# Altium project ElregSender_2022.PrjPcb (part 2 of 2)

## Sheet Sender_CH1.SchDoc
size A4
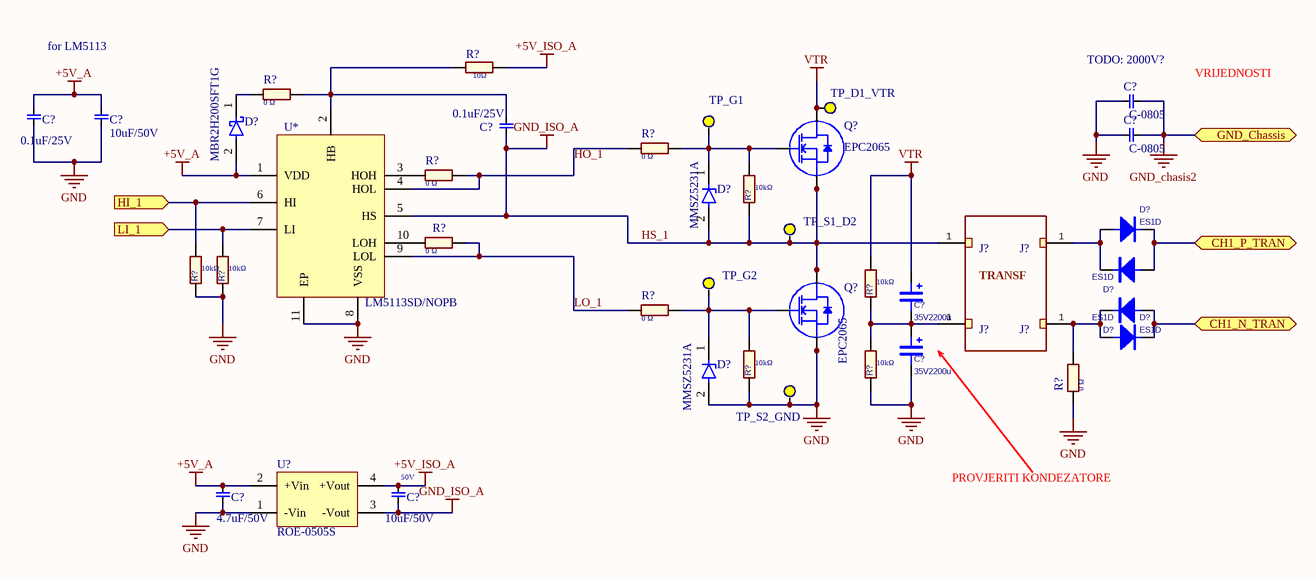
[diagram p3: Sender_CH1.SchDoc]

### Parts
(Parts that share a designator on the sheet are numbered #1, #2 ... from top to bottom, then left to right.)
C?#21  C-0805  [C-0805]
C?#22  0.1uF/25V  [C-0603]
C?#23  10uF/50V  [CAP-1210]
C?#24  0.1uF/25V  [C-0603]
C?#25  C-0805  [C-0805]
C?#26  35V2200u  [CAP_16X25]
C?#27  35V2200u  [CAP_16X25]
C?#28  4.7uF/50V  [FP-C2012X7R1H475K125AC-IPC_B]
C?#29  10uF/50V  Voltage: 50V  [CAP-1210]
D?#3  MBR2H200SFT1G  [FP-498-MFG]
D?#4  MMSZ5231A  [SOD-123]
D?#5  ES1D  [SMA]
D?#6  ES1D  [SMA]
D?#7  ES1D  [SMA]
D?#8  ES1D  [SMA]
D?#9  MMSZ5231A  [SOD-123]
J?#5  CON1_b  [CONN1 _b]  (value not drawn)
J?#6  CON1_b  [CONN1 _b]  (value not drawn)
J?#7  CON1_b  [CONN1 _b]  (value not drawn)
J?#8  CON1_b  [CONN1 _b]  (value not drawn)
Q?#1  EPC2065  [D0320T34M]
Q?#2  EPC2065  [D0320T34M]
R?#9  Resistance: 10Ω  [RES 0603_1608]  (hidden comment: RC0603FR-0710RL)
R?#10  Resistance: 0 Ω  [RES 0603_1608]  (hidden comment: RC0603JR-070RL)
R?#11  Resistance: 0 Ω  [RES 0603_1608]  (hidden comment: RC0603JR-070RL)
R?#12  Resistance: 0 Ω  [RES 0603_1608]  (hidden comment: RC0603JR-070RL)
R?#13  Resistance: 10kΩ  [RES 0603_1608]  (hidden comment: RC0603FR-0710KL)
R?#14  Resistance: 0 Ω  [RES 0603_1608]  (hidden comment: RC0603JR-070RL)
R?#15  Resistance: 10kΩ  [RES 0603_1608]  (hidden comment: RC0603FR-0710KL)
R?#16  Resistance: 10kΩ  [RES 0603_1608]  (hidden comment: RC0603FR-0710KL)
R?#17  Resistance: 0 Ω  [RES 0603_1608]  (hidden comment: RC0603JR-070RL)
R?#18  Resistance: 10kΩ  [RES 0603_1608]  (hidden comment: RC0603FR-0710KL)
R?#19  Resistance: 0 Ω  [RES 0603_1608]  (hidden comment: RC0603JR-070RL)
R?#20  Resistance: 10kΩ  [RES 0603_1608]  (hidden comment: RC0603FR-0710KL)
R?#21  Resistance: 10kΩ  [RES 0603_1608]  (hidden comment: RC0603FR-0710KL)
TP_D1_VTR  Test_Point  [Test_Point]  (value not drawn)
TP_G1  Test_Point  [Test_Point]  (value not drawn)
TP_G2  Test_Point  [Test_Point]  (value not drawn)
TP_S1_D2  Test_Point  [Test_Point]  (value not drawn)
TP_S2_GND  Test_Point  [Test_Point]  (value not drawn)
U*  LM5113SD/NOPB  [WSON-10]
U?#4  ROE-0505S  [ROE-0505S-MFG]

### Blocks framed on the sheet
TRANSF: J?#5 J?#7

### Ports
CH1_N_TRAN (bidir), CH1_P_TRAN (bidir), GND_Chassis (bidir), HI_1 (in), LI_1 (in)

### Nets
+5V_A: C?#22.1(G) C?#23.2(G) C?#28.2(G) D?#3.2(A) U*.1(VDD) U?#4.2(+Vin)
+5V_ISO_A: C?#29.2(G) R?#9.2 U?#4.4(+Vout)
GND: C?#21.1(G) C?#22.2(G) C?#23.1(G) C?#25.1(G) C?#27.2 C?#28.1(G) D?#9.2(A) Q?#2.2(S) Q?#2.4(S) Q?#2.6(S) Q?#2.8(S) R?#15.1 R?#16.1 R?#19.1 R?#20.1 R?#21.1 TP_S2_GND.1 U*.8(VSS) U*.11(EP) U?#4.1(-Vin)
GND_chasis2: C?#21.2(G) C?#25.2(G) ; port GND_Chassis
HS_1: C?#24.1(G) C?#29.1(G) D?#4.2(A) J?#5.1 Q?#1.2(S) Q?#1.4(S) Q?#1.6(S) Q?#1.8(S) Q?#2.3(D) Q?#2.5(D) Q?#2.7(D) R?#13.1 TP_S1_D2.1 U*.5(HS) U?#4.3(-Vout)  [also labelled GND_ISO_A]
VTR: C?#26.1 Q?#1.3(D) Q?#1.5(D) Q?#1.7(D) R?#18.2 TP_D1_VTR.1
HO_1: R?#11.1 R?#12.2 U*.4(HOL)
LO_1: R?#14.2 R?#17.1 U*.9(LOL)
NetC?#24_2: C?#24.2(G) R?#9.1 R?#10.2 U*.2(HB)
NetC?#26_2: C?#26.2 C?#27.1 J?#7.1 R?#18.1 R?#21.2
NetD?#3_1: D?#3.1(C) R?#10.1
NetD?#4_1: D?#4.1(C) Q?#1.1(G) R?#11.2 R?#13.2 TP_G1.1
NetD?#5_1: D?#5.1(A) D?#6.2(C) J?#6.1
NetD?#5_2: D?#5.2(C) D?#6.1(A) ; port CH1_P_TRAN
NetD?#7_1: D?#7.1(A) D?#8.2(C) J?#8.1 R?#19.2
NetD?#7_2: D?#7.2(C) D?#8.1(A) ; port CH1_N_TRAN
NetD?#9_1: D?#9.1(C) Q?#2.1(G) R?#17.2 R?#20.2 TP_G2.1
NetR?#12_1: R?#12.1 U*.3(HOH)
NetR?#14_1: R?#14.1 U*.10(LOH)
NetR?#15_2: R?#15.2 U*.6(HI) ; port HI_1
NetR?#16_2: R?#16.2 U*.7(LI) ; port LI_1

### Notes on the sheet
- for LM5113
- (near C?#21) TODO: 2000V?
- VRIJEDNOSTI
- PROVJERITI KONDEZATORE

### Library data of the parts
C?#21 C?#25 = C-0805: Manufacturer 1: Yageo; Manufacturer Part Number 1: CC1206KKX7RBBB332; Tolerance: ±10%; Voltage - Rated: 500V; Temperature Coefficient: X7R; Notification: Current market demand for these product types have resulted in fluctuating and extending lead times. Lead times may differ.; Description 1: CAP CER 3300PF 500V X7R 1206; Category 1: Capacitors; Packaging: Cut Tape (CT); Part Status: Active; Operating Temperature: -55°C ~ 125°C; Features: -; Ratings: -; Applications: General Purpose; Failure Rate: -; Mounting Type: Surface Mount, MLCC; Package / Case: 1206 (3216 Metric); Size / Dimension: 0.126" L x 0.063" W (3.20mm x 1.60mm); Height - Seated (Max): -; Thickness (Max): 0.057" (1.45mm); Lead Spacing: -; Lead Style: -; ComponentLink1URL: http://www.yageo.com/documents/recent/UPY-NP0X7R_MV_100-to-630V_21.pdf; ComponentLink1Description: http://www.yageo.com/documents/recent/UPY-NP0X7R_MV_100-to-630V_21.pdf; Supplier 1: Digi-Key; Supplier Part Number 1: 311-1506-1-ND; RoHS 1: RoHS Compliant; Stock 1: 4928; Pricing 1: 1=0.31, 10=0.214, 100=0.1085, 500=0.07424, 1000=0.06568 (USD)
C?#22 C?#24 = 06033C104JAZ2A: 0.1µF ±5% 25V Ceramic Capacitor X7R 0603 (1608 Metric); Manufacturer: Kyocera AVX; Capacitance: 100nF; ComponentLink1URL: http://catalogs.avx.com/SurfaceMount.pdf?src-supplier=Digi-Key; ComponentLink1Description: http://catalogs.avx.com/SurfaceMount.pdf?src-supplier=Digi-Key; Case/Package: 0603; Category: Ceramic Capacitors; Dielectric: X7R; Features: Soft Termination; Length: 0.063inch; Manufacturer Part Number: 06033C104JAZ2A; Max Operating Temperature: 125°C; Min Operating Temperature: -55°C; Mount: Surface Mount; Package Quantity: 4000; Packaging: Tape and Reel; RoHS Compliant: Yes; Thickness: 0.035inch; Tolerance: 5%; Voltage Rating: 25V; Voltage Rating (DC): 25V; Width: 0.031inch
C?#23 C?#29 = CL32B106KBJNNNE: 10 µF 50V ±10%  Ceramic Capacitor X7R 1210 (3225 Metric); Manufacturer: Samsung; Capacitance: 10uF; ComponentLink1URL: https://datasheet.ciiva.com/25766/cl32b106kbjnnne-25766545.pdf?src-supplier=Digi-Key; ComponentLink1Description: https://datasheet.ciiva.com/25766/cl32b106kbjnnne-25766545.pdf?src-supplier=Digi-Key; Case/Package: 1210; Category: Ceramic Capacitors; Dielectric: X7R; Length: 3.2mm; Manufacturer Part Number: CL32B106KBJNNNE; Max Operating Temperature: 125°C; Min Operating Temperature: -55°C; Mount: Surface Mount; Package Quantity: 1; Packaging: Tape and Reel; RoHS Compliant: Yes; Thickness: 0.106inch; Tolerance: 10%; Voltage Rating: 50V; Voltage Rating (DC): 50V; Width: 0.098inch; Supplier 1: Mouser; Supplier 2: Mouser; Case Code (Imperial): 1210; Case Code (Metric): 3225; Construction: Flat; Depth: 2.5mm; Height: 2.5mm; Lead Free: Lead Free; Material: Ceramic; Radiation Hardening: No; Series: CL; Supplier Packaging 1: Tape & Reel; Supplier Unit Price 1: $0.59; Supplier Location 1: US; Supplier Part Number 1: 187-CL32B106KBJNNNE; Supplier Part Number 2: 187-CL32B106KBJNNNE
  C?#23: Voltage: 50V
C?#26 C?#27 = CAP_2200uF_35V: Capacitor; Manufacturer: Kemet; Manufacturer Part Number: ESH228M035AM7AA; Capacitance: 2200µF; Tolerance: ±20%; Voltage Rating: 35V; Lifetime @ Temp.: 2000 Hrs @ 105°C; Supplier 1: Digi-Key; Supplier Part Number 1: 399-6572-ND; RoHS: RoHS Compliant; Category: Capacitors; Stock 1: 1972; Pricing 1: 1=0.98, 10=0.77, 50=0.6676, 100=0.5778, 250=0.5136, 500=0.43656, 1000=0.3852, 2500=0.35952, 5000=0.34668 (USD); Packaging: Bulk; ESR (Equivalent Series Resistance): -; Operating Temperature: -40°C ~ 105°C; Type: -; Applications: General Purpose; Ripple Current: -; Impedance: -; Lead Spacing: 0.295" (7.50mm); Size / Dimension: 0.630" Dia (16.00mm); Height - Seated (Max): 1.063" (27.00mm); Surface Mount Land Size: -; Mounting Type: Through Hole; Package / Case: Radial, Can; ComponentLink1URL: http://www.kemet.com/docfinder?Partnumber=ESH228M035AM7AA; ComponentLink1Description: http://www.kemet.com/docfinder?Partnumber=ESH228M035AM7AA
C?#28 = C2012X7R1H475K125AC: 4.7uF 50V 10% 0805 T/R Multilayer Ceramic Capacitor; Manufacturer: TDK; Capacitance: 4.7uF; Category: Ceramic Capacitors; Manufacturer Part Number: C2012X7R1H475K125AC; RoHS Compliant: No; Supplier 1: Digi-Key; RoHS: Yes; Stock 1: 123424; Pricing 1: 1=0.57000, 10=0.40600, 50=0.30680, 100=0.26730, 500=0.19800, 1000=0.16830 (USD); Supplier 2: Mouser; Supplier Part Number 2: 810-C2012X7R475K125C; Supplier Part Number 1: 445-C2012X7R1H475K125ACCT-ND; Voltage: 50V
D?#3 = MBR2H200SFT1G: DIODE SCHOTTKY 200V 2A SOD123FL; Manufacturer: ON Semiconductor; Peak Reverse Current: 200uA; Max Surge Forward Current: 30A; Max Junction Temp: +150°C; Standoff Height: 0mm; Device Class L1: Discrete Semiconductors; Package: 498; Temperature Range High: +150°C; Height: 0.98mm; Temperature: -55°C to +150°C; Forward Current: 2A; Octopart: https://octopart.com/mbr2h200sft1g-on+semiconductor-51167333; Reverse Voltage: 200V; Max Repetitive Reverse Voltage: 200V; RoHS: TRUE; Lead Free: Yes; Footprint Url: https://www.onsemi.com/pub/Collateral/498-01.PDF; ComponentLink2Description: Datasheet; Category: Diode; Manufacturer Part Number: MBR2H200SFT1G; Digikey Description: DIODE SCHOTTKY 200V 2A SOD123FL; Device Class L3: Schottky Diodes; Temperature Range Low: -55°C; ComponentLink2URL: https://www.onsemi.com/pub/Collateral/MBR2H200SF-D.PDF; Automotive: No; Device Class L2: Diodes
D?#4 D?#9 = MMSZ5231A_R1_00001: Zener Diode 5.1 V 500 mW ±1.96% Surface Mount SOD-123; Manufacturer: Pan Jit; Element Configuration: Single; Max Power Dissipation: 500mW; Max Reverse Leakage Current: 5uA; Zener Voltage: 5.1V; Radiation Hardening: No; Category: Zener Diodes; Max Operating Temperature: 150°C; Min Operating Temperature: -50°C; Mount: Surface Mount; Number of Pins: 2; RoHS Compliant: Yes; Supplier 1: Digi-Key; Supplier Part Number 1: 3757-MMSZ5231A_R1_00001CT-ND; Supplier Unit Price 1: $0.20; Supplier Location 1: US; Supplier 2: Mouser; Supplier Part Number 2: 241-MMSZ5231AR100001; Supplier Unit Price 2: $0.20; Supplier Location 2: US; Manufacturer Part Number: MMSZ5231A_R1_00001
D?#5-D?#8 = ES1x: Diode; Manufacturer: Fairchild/ON Semiconductor; Diode Type: Standard; Voltage - DC Reverse (Vr) (Max): 200V; Current - Average Rectified (Io): 1A; Voltage - Forward (Vf) (Max) @ If: 920mV @ 1A; Speed: Fast Recovery =< 500ns, > 200mA (Io); Reverse Recovery Time (trr): 15ns; Current - Reverse Leakage @ Vr: 5μA @ 200V; Capacitance @ Vr, F: 7pF @ 4V, 1MHz; Supplier 1: Digi-Key; Supplier Part Number 1: ES1DFSTR-ND; Manufacturer Part Number: ES1D; RoHS: RoHS Compliant; Category: Discrete Semiconductor Products; Stock 1: 135000; Pricing 1: 7500=0.0567, 15000=0.0504, 37500=0.04725, 52500=0.0419, 187500=0.04032 (USD); Packaging: Tape & Reel (TR); Part Status: Active; Mounting Type: Surface Mount; Package / Case: DO-214AC, SMA; Supplier Device Package: SMA (DO-214AC); Operating Temperature - Junction: -55°C ~ 150°C; ComponentLink1URL: https://www.fairchildsemi.com/datasheets/ES/ES1A.pdf; ComponentLink1Description: https://www.fairchildsemi.com/datasheets/ES/ES1A.pdf
Q?#1 Q?#2 = EPC2065: N-Channel 80 V 60A (Ta) Surface Mount Die; QSGdescript: 80 V 60A 3.6mE; MFG: EPC; Part Number: EPC2065; EPC Part Number: EPC2065; Status: Released; Supplier 1: Digi-Key; Supplier Part Number 1: 917-EPC2065TR-ND; Supplier 2: Digi-Key; Supplier 3: Digi-Key; SchDescript: 80 V 60A 3.6mE; MFGPN: EPC2065
R?#9 = RC0603FR-0710RL: 10 Ohms ±1% 0.1W, 1/10W Chip Resistor 0603 (1608 Metric) Moisture Resistant Thick Film; Manufacturer: Yageo; Max Power Dissipation: 100mW; Temperature Coefficient: 200ppm/°C; Voltage Rating: 50V; Case Code (Imperial): 0603; Case Code (Metric): 1608; Case/Package: 0603; Category: Chip SMD Resistors; Construction: Rectangular; Contact Plating: Tin,Matte; Depth: 0.8mm; Features: Moisture Resistant; Height: 0.45mm; Lead Free: Lead Free; Length: 1.6mm; Max Operating Temperature: 155°C; Military Standard: Not; Min Operating Temperature: -55°C; Number of Terminations: 2; Packaging: Tape and Reel; Power Rating: 100mW; Radiation Hardening: No; REACH SVHC: No SVHC; Resistance Tolerance: 1%; Resistor Type: Thick Film; RoHS Compliant: Yes; Series: RC; Size Code: 0603; Technology: THICK FILM; Termination: SMD/SMT; Tolerance: 1%; Supplier 1: Mouser; Supplier Part Number 1: 603-RC0603FR-0710RL; Supplier Packaging 1: Tape & Reel; Supplier Unit Price 1: $0.10; Supplier Location 1: US; Supplier 2: Farnell; Supplier Part Number 2: 9238247; Supplier Packaging 2: Cut Tape; Supplier Unit Price 2: £0.032; Supplier Location 2: GB; Manufacturer Part Number: RC0603FR-0710RL; Number of Pins: 2; Voltage Rating (DC): 50V; Width: 0.8mm
R?#10-R?#12 R?#14 R?#17 = RC0603JR-070RL: 0 Ohms Jumper 0.1W, 1/10W Chip Resistor 0603 (1608 Metric) Moisture Resistant Thick Film; Manufacturer: Yageo; Max Power Dissipation: 100mW; Resistance Tolerance: 5%; Temperature Coefficient: 200ppm/°C; Tolerance: 1%; Voltage Rating: 50V; Case Code (Imperial): 0603; Case Code (Metric): 1608; Case/Package: 0603; Category: Chip SMD Resistors; Construction: Rectangular; Contact Plating: Tin,Matte; Depth: 0.8mm; Features: Moisture Resistant; Height: 0.45mm; Lead Free: Lead Free; Length: 1.6mm; Manufacturer Part Number: RC0603JR-070RL; Max Operating Temperature: 155°C; Military Standard: Not; Min Operating Temperature: -55°C; Number of Pins: 2; Number of Terminations: 2; Package Quantity: 5000; Packaging: Tape and Reel; Power Rating: 100mW; Radiation Hardening: No; REACH SVHC: No SVHC; Resistor Type: Thick Film; RoHS Compliant: Yes; Series: RC; Size Code: 0603; Voltage Rating (DC): 50V; Width: 0.8mm; Technology: THICK FILM; Termination: SMD/SMT; Supplier 1: Digi-Key; Supplier Part Number 1: 311-0.0GRCT-ND; Supplier 2: Mouser; Supplier Part Number 2: 603-RC0603JR-070RL; Supplier 3: Farnell; Supplier Part Number 3: 2421846
R?#13 R?#15 R?#16 R?#18 R?#20 R?#21 = RC0603FR-0710KL: 10 kOhms ±1% 0.1W, 1/10W Chip Resistor 0603 (1608 Metric) Moisture Resistant Thick Film; Manufacturer: Yageo; Max Power Dissipation: 100mW; Temperature Coefficient: 100ppm/°C; Voltage Rating: 75V; Voltage Rating (DC): 50V; Width: 0.8mm; Case Code (Imperial): 0603; Case Code (Metric): 1608; Case/Package: 0603; Category: Chip SMD Resistors; Depth: 0.8mm; Height: 0.45mm; Lead Free: Lead Free; Length: 1.6mm; Manufacturer Part Number: RC0603FR-0710KL; Max Operating Temperature: 155°C; Min Operating Temperature: -55°C; Number of Pins: 2; Number of Terminations: 2; Packaging: Tape and Reel; Power Rating: 100mW; REACH SVHC: Unknown; Resistance Tolerance: 1%; Resistor Type: Thick Film; RoHS Compliant: Yes; Series: RC; Size Code: 0603; Termination: SMD/SMT; Tolerance: 1%; Weight: 7.1E-05oz; Construction: Rectangular; Features: Moisture Resistant; Lead Pitch: 0.3mm; Military Standard: Not; Supplier 1: Digi-Key; Supplier Part Number 1: 311-10.0KHRCT-ND; Supplier Packaging 1: Cut Tape; Supplier Unit Price 1: $0.10; Supplier Location 1: US; Supplier 2: Mouser; Supplier Part Number 2: 603-RC0603FR-0710KL; Supplier Packaging 2: Tape & Reel; Supplier Unit Price 2: $0.10; Supplier Location 2: US
R?#19 = RC0603JR-070RL: 0 Ohms Jumper 0.1W, 1/10W Chip Resistor 0603 (1608 Metric) Moisture Resistant Thick Film; Manufacturer: Yageo; Category 1: Resistors; Max Power Dissipation: 100mW; Resistance Tolerance: 5%; Temperature Coefficient: 200ppm/°C; Tolerance: 1%; Voltage Rating: 50V; Features: Moisture Resistant; Case Code (Imperial): 0603; Case Code (Metric): 1608; Case/Package: 0603; Category: Chip SMD Resistors; Construction: Rectangular; Contact Plating: Tin,Matte; Depth: 0.8mm; Height: 0.45mm; Lead Free: Lead Free; Length: 1.6mm; Max Operating Temperature: 155°C; Military Standard: Not; Min Operating Temperature: -55°C; Number of Pins: 2; Number of Terminations: 2; Package Quantity: 5000; Packaging: Tape and Reel; Power Rating: 100mW; Radiation Hardening: No; REACH SVHC: No SVHC; Resistor Type: Thick Film; RoHS Compliant: Yes; Series: RC; Size Code: 0603; Technology: THICK FILM; Termination: SMD/SMT; Voltage Rating (DC): 50V; Width: 0.8mm; Manufacturer Part Number: RC0603JR-070RL; Supplier 1: Digi-Key; Supplier Part Number 1: 311-0.0GRCT-ND; Supplier 2: Mouser; Supplier Part Number 2: 603-RC0603JR-070RL; Supplier 3: Farnell; Supplier Part Number 3: 2421846
U* = LM5113SD/NOPB: Half-Bridge Gate Driver IC Non-Inverting 10-WSON (4x4); Manufacturer: TI National Semiconductor; Max Output Current: 5A; Fall Time: 4ns; Max Supply Voltage: 5.5V; Min Supply Voltage: 4.5V; Number of Channels: 2; Operating Supply Current: 100uA; Operating Supply Voltage: 5V; Propagation Delay: 30ns; Turn-Off Delay Time: 2ns; Category: Gate Drivers; Lead Free: Lead Free; Max Operating Temperature: 125°C; Min Operating Temperature: -40°C; Mount: Surface Mount; Number of Drivers: 2; Number of Outputs: 2; Number of Pins: 10; Output Current: 5A; Packaging: Tape and Reel; Radiation Hardening: No; REACH SVHC: No SVHC; Rise Time: 4ns; RoHS Compliant: Yes; Series: LM5113; Turn-On Delay Time: 2ns; Supplier 1: Digi-Key; Supplier Part Number 1: LM5113SD/NOPBCT-ND; Supplier Packaging 1: Cut Tape; Supplier Unit Price 1: $6.36; Supplier Location 1: US; Supplier 2: Mouser; Supplier Part Number 2: 926-LM5113SD/NOPB; Supplier Packaging 2: Tape & Reel; Supplier Unit Price 2: $6.36; Supplier Location 2: US; Supplier 3: Farnell; Supplier Part Number 3: 2781701; Supplier Unit Price 3: £5.09; Supplier Location 3: GB; Manufacturer Part Number: LM5113SD/NOPB
U?#4 = ROE-0505S: Isolated Module DC DC Converter 1 Output 5V 200mA 4.5V - 5.5V Input; Manufacturer: Recom; Isolation Voltage: 1kV; Efficiency: 75%; Max Output Power: 1W; Number of Outputs: 1; Case/Package: SIP; Category: Voltage Regulators - Switching; Current - Output 1: 200mA; Depth: 6mm; Height: 10mm; Isolation: Isolated; Lead Free: Lead Free; Length: 11.5mm; Max Input Voltage: 5.5V; Max Input Voltage (DC): 5.5V; Max Operating Temperature: 85°C; Max Output Current: 200mA; Max Output Voltage: 5V; Max Power Dissipation: 1W; Min Input Voltage: 4.5V; Min Input Voltage (DC): 4.5V; Min Operating Temperature: -40°C; Mount: Through Hole; Nominal Input Voltage: 5V; Nominal Output Voltage: 5V; Number of Pins: 4; Output Current: 200mA; Output Power: 1W; Output Voltage: 5V; Package Quantity: 42; Packaging: Rail/Tube; Power Rating: 1W; REACH SVHC: No SVHC; RoHS Compliant: Yes; Series: ROE; Voltage - Output 1: 5V; Weight: 1.4g; Width: 6mm; Supplier 1: Mouser; Supplier Part Number 1: 919-ROE-0505S; Supplier Packaging 1: Tube; Supplier Unit Price 1: $3.12; Supplier Location 1: US; Supplier 2: Farnell; Supplier Part Number 2: 2218597; Supplier Packaging 2: Each; Supplier Unit Price 2: £3.01; Supplier Location 2: GB; Manufacturer Part Number: ROE-0505S

## Nets that join several sheets
GND: Sender_Top (J?#2.2), FPGA (40 pins), Sender_Power (26 pins), Sender_CH1 (20 pins)
VTR: Sender_Power (10 pins), Sender_CH1 (6 pins)